# EAGLE design stabilizer (EAGLE 7.2.0)
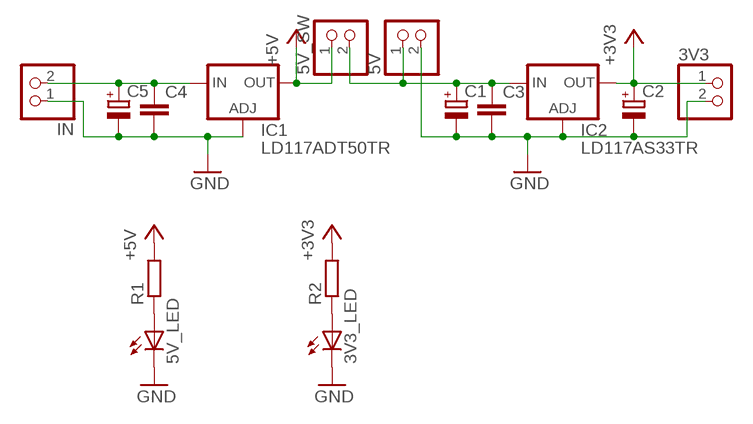
[diagram p0: schematic, sheet 1]

## Parts
3V3  PINHD-1X2  [1X02]
3V3_LED  LEDSML0805  [SML0805]
5V  PINHD-1X2  [1X02]
5V_LED  LEDSML0805  [SML0805]
5V_SW  PINHD-1X2  [1X02]
C1  CPOL-EUD  [PANASONIC_D]
C2  CPOL-EUD  [PANASONIC_D]
C3  C-EUC0805  [C0805]
C4  C-EUC0805  [C0805]
C5  CPOL-EUD  [PANASONIC_D]
IC1  LD117ADT50TR  [DPACK]
IC2  LD117AS33TR  [SOT223]
IN  PINHD-1X2  [1X02]
R1  R-EU_R0805  [R0805]
R2  R-EU_R0805  [R0805]

## Nets
+3V3: 3V3.1 C2.+ IC2.4(OUT) R2.2
+5V: 5V_SW.1 IC1.4(OUT) R1.2
GND: 3V3.2 3V3_LED.C 5V.2 5V_LED.C C1.- C2.- C3.2 C4.2 C5.- IC1.1(ADJ) IC2.1(ADJ) IN.1
N$1: 5V_LED.A R1.1
N$2: 3V3_LED.A R2.1
N$4: C4.1 C5.+ IC1.3(IN) IN.2
N$6: 5V.1 5V_SW.2 C1.+ C3.1 IC2.3(IN)

## Library data of the parts
3V3 5V 5V_SW IN = pinhead:PINHD-1X2: PIN HEADER
3V3_LED 5V_LED = led:LED: LED OSRAM: - CHIPLED LG R971, LG N971, LY N971, LG Q971, LY Q971, LO R971, LY R971 LH N974, LH R974 LS Q976, LO Q976, LY Q976 LO Q996 - Hyper CHIPLED LW Q18S LB Q993, LB Q99A, LB R99A - SideLED LS A670, LO A670, LY A670, LG A670, LP A670 LB A673, LV A673, LT A673, LW A673 LH A674 LY A675 LS A676, LA A676, LO A676, LY A676, LW A676 LS A679, LY A679, LG A679 - Hyper Micro SIDELED® LS Y876, LA Y876, LO Y876, LY Y876 LT Y87S - SmartLED LW L88C, LW L88S LB L89C, LB L89S, LG L890 LS L89K, LO L89K, LY L89K LS L896, LA L896, LO L896, LY L896 - TOPLED LS T670, LO T670, LY T670, LG T670, LP T670 LSG T670, LSP T670, LSY T670, LOP T670, LYG T670 LG T671, LOG T671, LSG T671 LB T673, LV T673, LT T673, LW T673 LH T674 LS T676, LA T676, LO T676, LY T676, LB T676, LH T676, LSB T676, LW T676 LB T67C, LV T67C, LT T67C, LS T67K, LO T67K, LY T67K, LW E67C LS E67B, LA E67B, LO E67B, LY E67B, LB E67C, LV E67C, LT E67C LW T67C LS T679, LY T679, LG T679 LS T770, LO T770, LY T770, LG T770, LP T770 LB T773, LV T773, LT T773, LW T773 LH T774 LS E675, LA E675, LY E675, LS T675 LS T776, LA T776, LO T776, LY T776, LB T776 LHGB T686 LT T68C, LB T68C - Hyper Mini TOPLED® LB M676 - Mini TOPLED Santana® LG M470 LS M47K, LO M47K, LY M47K Source: http://www.osram.convergy.de LUXEON: - LUMILED® LXK2-PW12-R00, LXK2-PW12-S00, LXK2-PW14-U00, LXK2-PW14-V00 LXK2-PM12-R00, LXK2-PM12-S00, LXK2-PM14-U00 LXK2-PE12-Q00, LXK2-PE12-R00, LXK2-PE12-S00, LXK2-PE14-T00, LXK2-PE14-U00 LXK2-PB12-K00, LXK2-PB12-L00, LXK2-PB12-M00, LXK2-PB14-N00, LXK2-PB14-P00, LXK2-PB14-Q00 LXK2-PR12-L00, LXK2-PR12-M00, LXK2-PR14-Q00, LXK2-PR14-R00 LXK2-PD12-Q00, LXK2-PD12-R00, LXK2-PD12-S00 LXK2-PH12-R00, LXK2-PH12-S00 LXK2-PL12-P00, LXK2-PL12-Q00, LXK2-PL12-R00 Source: www.luxeon.com KINGBRIGHT: KA-3528ASYC Source: www.kingbright.com
C1 C2 C5 = rcl:CPOL-EU: POLARIZED CAPACITOR, European symbol
C3 C4 = rcl:C-EU: CAPACITOR, European symbol
IC1 IC2 = v-reg:LD117A?*: Low drop fixed and adjustable positive voltage regulators 1 A Source: http://www.st.com/stonline/products/literature/ds/7194/ld1117axx.pdf
R1 R2 = rcl:R-EU_: RESISTOR, European symbol

## Board
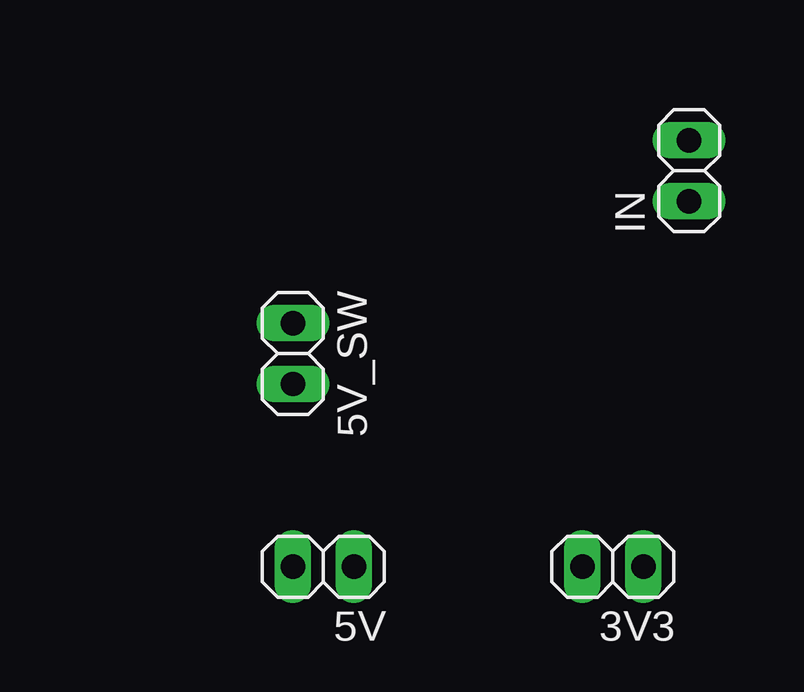
[diagram p1: board, top side]
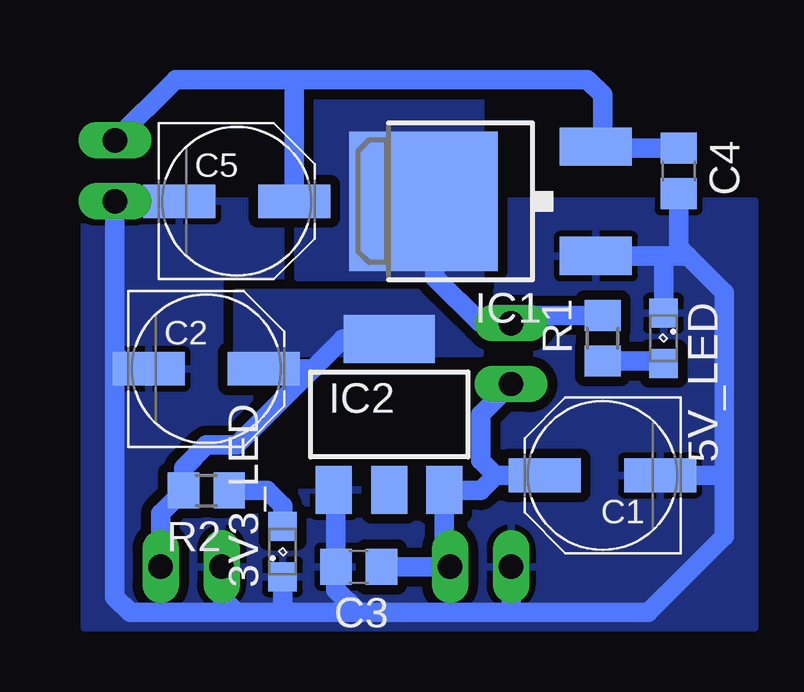
[diagram p2: board, bottom side, seen from below]

No outline drawn. Coordinates in mm, seen from the top.
Copper layers (1*16): Top 0.035mm / dielectric 1.5mm / Bottom 0.035mm
Design rules "default *": minimum track width 10mil, minimum drill 24mil, track to track 8mil, track to pad 8mil, pad to pad 8mil, via to via 8mil, smd to smd 8mil, copper to edge 40mil, drill to drill 8mil, minimum pad ring 10mil, minimum via ring 8mil, stop-mask expansion 4mil, vias tented up to drill 0mil, thermal gap 10mil
bRestrict: area 50.8,15.2 to 52.1,17.8

### Footprints (pad centres in the part's own frame; a part is rotated, then mirrored left to right if it is on the bottom)
1X02 = drill 1.016 long: 1 -1.27,0; 2 1.27,0
SML0805 = smd 1.2 x 1.2: A 1.05,0; C -1.05,0
PANASONIC_D = smd 3 x 1.4: + 2.4,0; - -2.4,0
C0805 = smd 1.3 x 1.5: 1 -0.95,0; 2 0.95,0
DPACK = smd 1.6 x 3: 1 -2.28,-4.8; 3 2.28,-4.8 | smd 5.8 x 6.2: 4 0,2.38
SOT223 = smd 1.5 x 2: 1 -2.3,-3.15; 2 0,-3.15; 3 2.3,-3.15 | smd 3.8 x 2: 4 0,3.15
R0805 = smd 1.3 x 1.5: 1 -0.95,0; 2 0.95,0

### Placement (x,y rotation side)
3V3  56.52,11.43 180 top
3V3_LED  52.7,12.06 90 bottom
5V  44.45,11.43 180 top
5V_LED  36.83,20.95 270 bottom
5V_SW  43.18,20.32 270 top
C1  39.37,15.24 180 bottom
C2  55.88,19.68 0 bottom
C3  49.53,11.43 180 bottom
C4  36.2,27.94 270 bottom
C5  54.61,26.67 0 bottom
IC1  44.45,26.67 90 bottom
IC2  48.26,17.78 0 bottom
IN  59.69,27.94 90 top
R1  39.37,20.95 90 bottom
R2  55.88,14.61 180 bottom

### Tracks (layer width: path | path; a pad name or v marks a point on that pad's centre or on a via)
+3V3
  Bottom 0.813: C2.+ 51.44,19.68 | 51.44,19.68 50.19,20.93 IC2.4 | 3V3.1 57.78,13.65 R2.2 56.83,15.56 55.88,16.51 54.61,16.51 51.44,19.68
  pour Bottom (isolate 0.406, no thermals): 46.99,20.32 44.45,20.32 44.45,21.59 44.45,22.86 54.61,22.86 54.61,20.32
+5V
  Bottom 0.813: IC1.4 46.35,26.2 46.35,23.5 44.45,21.59 5V_SW.1 42.87,21.91 R1.2
  pour Bottom (isolate 0.406, no thermals): 44.45,31.75 44.45,23.5 52.07,23.5 52.07,31.75
GND
  Bottom 0.813: 49.53,9.53 50.48,10.47 C3.2 50.48,14.55 IC2.1 | 43.18,9.53 49.53,9.53 | 5V.2 43.18,9.53 | 3V3.2 55.24,10.16 54.61,9.53 | 54.61,9.53 52.7,9.53 | 52.7,9.53 49.53,9.53 | C1.- 34.29,15.24 | 34.29,15.24 34.29,12.7 37.47,9.53 43.18,9.53 | IC1.1 36.83,24.39 | 36.83,24.39 35.82,24.39 | 5V_LED.C 36.83,24.39 | 35.82,24.39 34.29,22.86 34.29,15.24 | C4.2 36.2,24.77 35.82,24.39 | 59.69,20.32 IN.1 C5.- | 59.69,20.32 59.69,10.16 59.05,9.53 54.61,9.53 | C2.- 59.05,19.68 59.69,20.32 | 3V3_LED.C 52.7,9.53
  pour Bottom (isolate 0.406, rank 2): 33.02,26.67 60.96,26.67 60.96,8.89 33.02,8.89
N$1
  Bottom 0.813: R1.1 36.93,20 5V_LED.A
N$2
  Bottom 0.813: R2.1 53.34,14.61 52.7,13.97 3V3_LED.A
N$4
  Bottom 0.813: C4.1 39.59,28.89 IC1.3 39.37,29.23 39.37,31.11 40.01,31.75 52.07,31.75 | 52.07,31.75 57.15,31.75 IN.2 | C5.+ 52.21,31.61 52.07,31.75
N$6
  Bottom 0.813: C3.1 5V.1 45.96,11.67 IC2.3 45.94,14.61 44.45,14.61 43.81,15.24 | C1.+ 43.81,15.24 | 5V_SW.2 44.45,17.78 44.45,15.88 43.81,15.24